# EAGLE design HEXTIr_v1.1 (EAGLE 7.7.0)
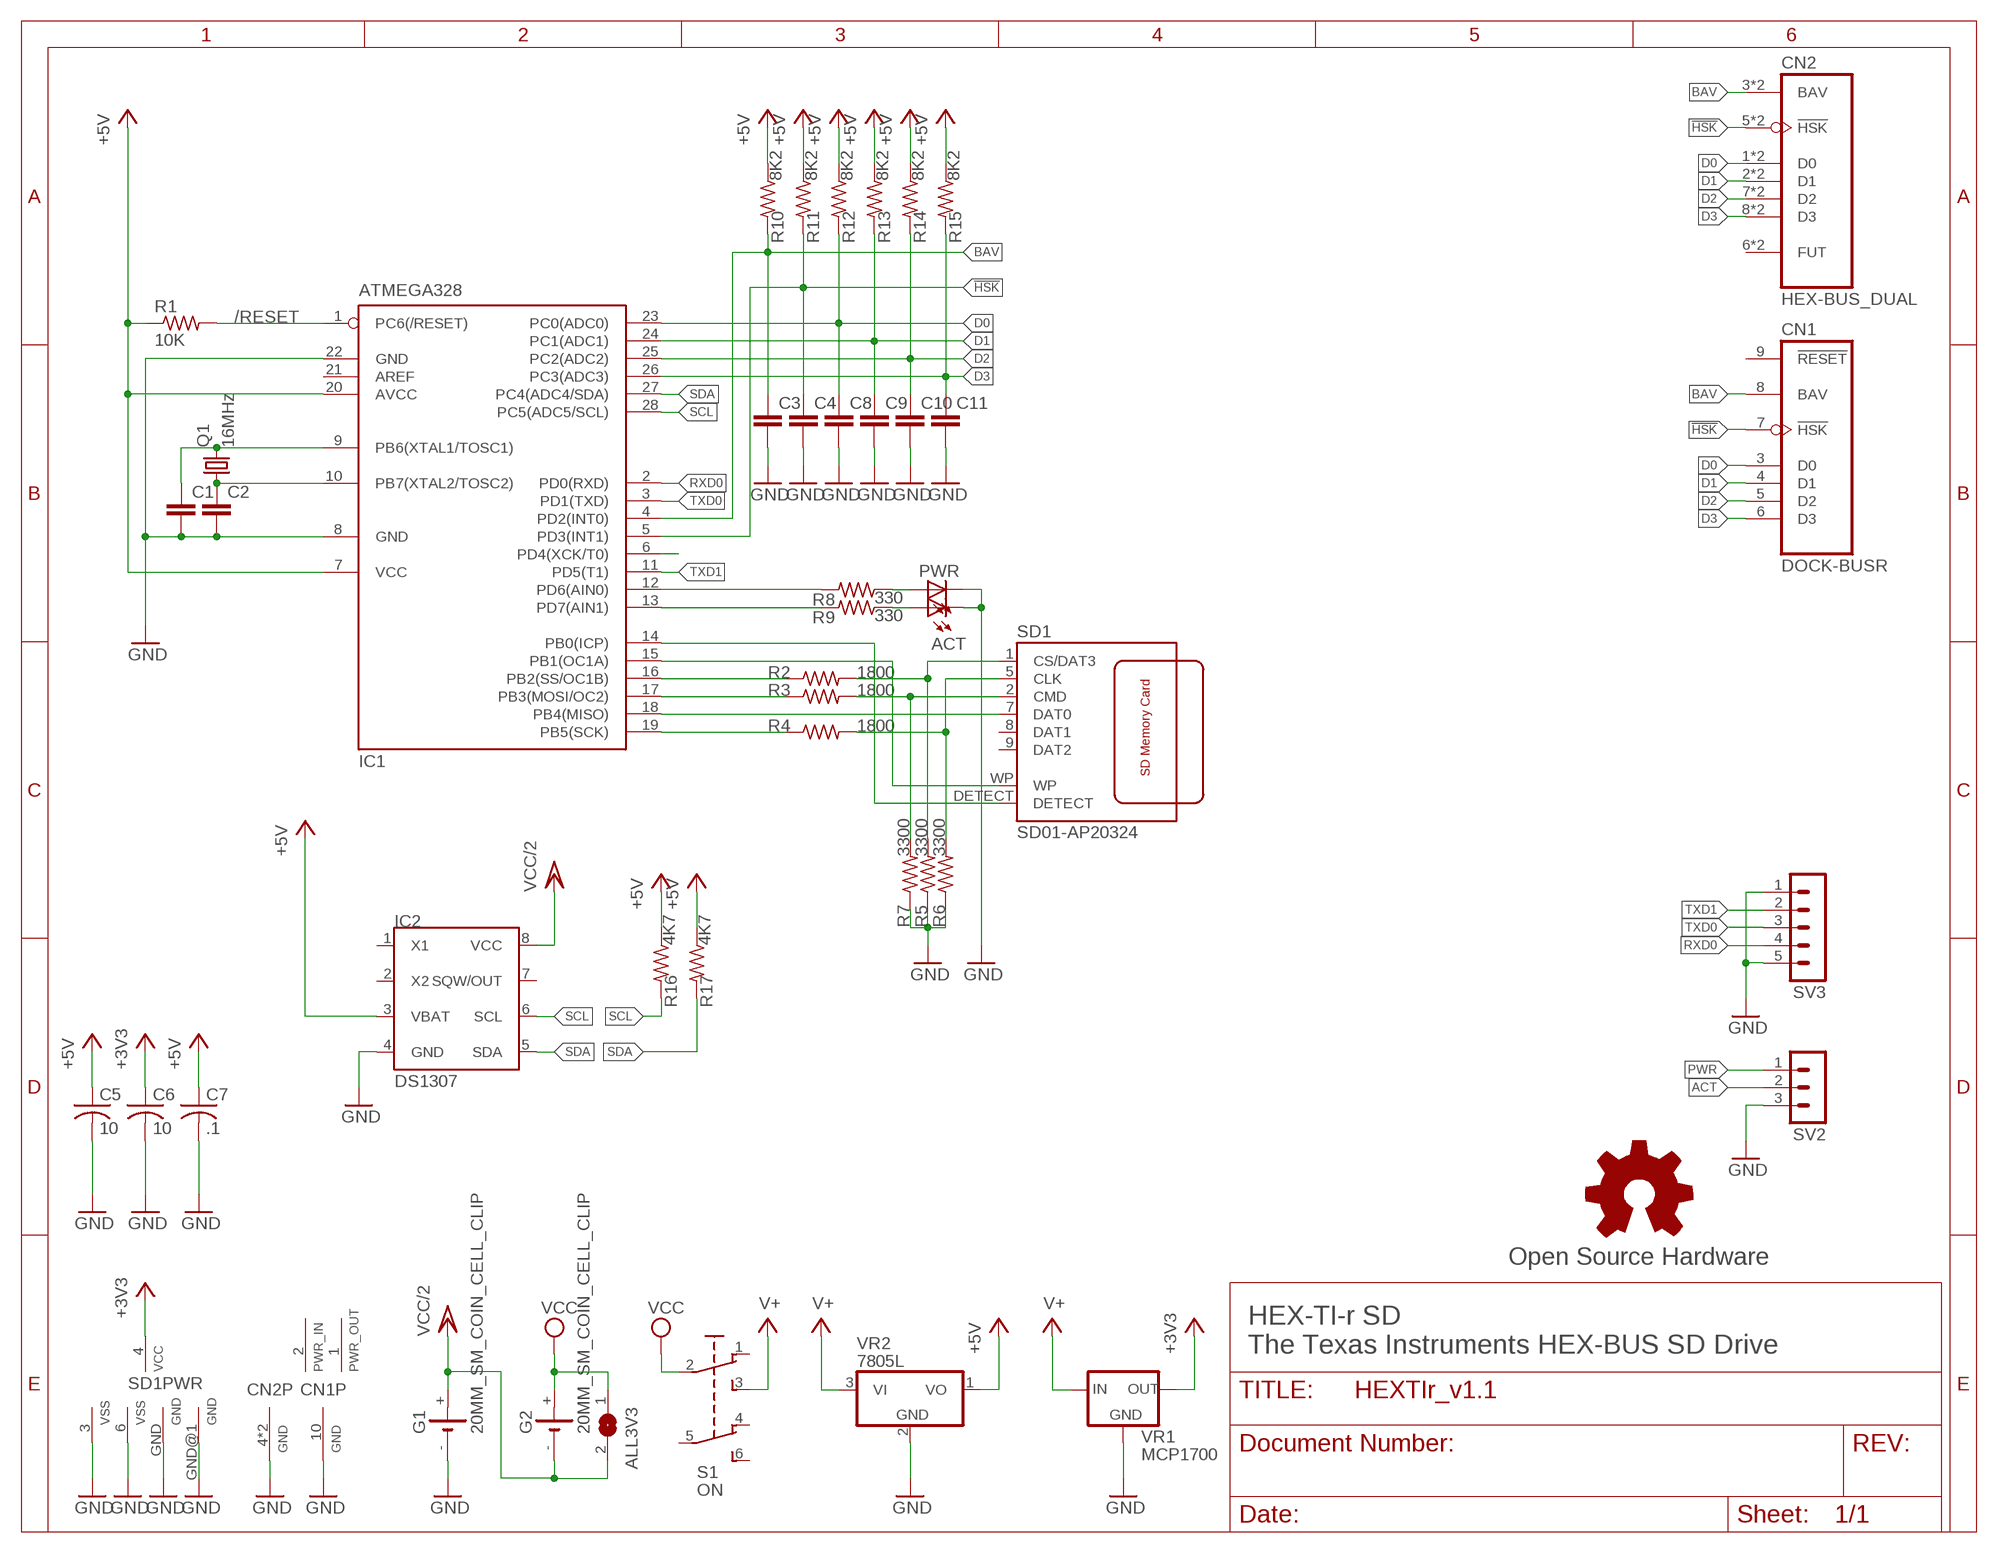
[diagram p0: schematic, sheet 1]

## Parts
ACT  LED3MM  [LED3MM]
ALL3V3  SJ  [SJ]
C1  C-EU025-024X044  [C025-024X044]
C2  C-EU025-024X044  [C025-024X044]
C3  C-EU025-024X044  [C025-024X044]
C4  C-EU025-024X044  [C025-024X044]
C5  10  C-US025-025X050  [C025-025X050]
C6  10  C-US025-025X050  [C025-025X050]
C7  .1  C-US025-025X050  [C025-025X050]
C8  C-EU025-024X044  [C025-024X044]
C9  C-EU025-024X044  [C025-024X044]
C10  C-EU025-024X044  [C025-024X044]
C11  C-EU025-024X044  [C025-024X044]
CN1  DOCK-BUSR  [DOCK-BUS-RP]
CN2  HEX-BUS_DUAL  [HEX-BUS_DUAL]
G1  20MM_SM_COIN_CELL_CLIP  [20MM_SM_COIN_CELL_CLIP]
G2  20MM_SM_COIN_CELL_CLIP  [20MM_SM_COIN_CELL_CLIP]
GOLD_ORB_SM1  Open Source Hardware  OSHWLOGOLOGO5MM  [OSHW_5MM]
IC1  ATMEGA328  MEGA8-P  [DIL28-3]
IC2  DS1307  [DIL08]
PWR  LED3MM  [LED3MM]
Q1  16MHz  CRYSTALHC49U-V  [HC49U-V]
R1  10K  R-US_0204/2V  [0204V]
R2  1800  R-US_0204/2V  [0204V]
R3  1800  R-US_0204/2V  [0204V]
R4  1800  R-US_0204/2V  [0204V]
R5  3300  R-US_0204/2V  [0204V]
R6  3300  R-US_0204/2V  [0204V]
R7  3300  R-US_0204/2V  [0204V]
R8  330  R-US_0204/2V  [0204V]
R9  330  R-US_0204/2V  [0204V]
R10  8K2  R-US_0204/2V  [0204V]
R11  8K2  R-US_0204/2V  [0204V]
R12  8K2  R-US_0204/2V  [0204V]
R13  8K2  R-US_0204/2V  [0204V]
R14  8K2  R-US_0204/2V  [0204V]
R15  8K2  R-US_0204/2V  [0204V]
R16  4K7  R-US_0204/2V  [0204V]
R17  4K7  R-US_0204/2V  [0204V]
S1  ON  TINY-SLIDE  [TINY-SLIDE]
SD1  SD01-AP20324  [SD01-AP20324]
SV2  MA03-1  [MA03-1]
SV3  MA05-1  [MA05-1]
VR1  MCP1700  MCP1700TO92  [TO92]
VR2  7805L  [TO92]

## Nets
!HSK: C4.1 CN1.7(!HSK) CN2.5'(!HSK) CN2.5(!HSK) IC1.5(PD3(INT1)) R11.2
+3V3: C6.1 SD1.4(3V3) VR1.3(OUT)
+5V: C5.1 C7.1 IC1.7(VCC) IC1.20(AVCC) IC2.3(VBAT) R1.1 R10.1 R11.1 R12.1 R13.1 R14.1 R15.1 R16.1 R17.1 VR2.1(VO)
/RESET: IC1.1(PC6(/RESET)) R1.2
ACT: IC1.13(PD7(AIN1)) R9.2 SV2.2
B2: C1.1 IC1.9(PB6(XTAL1/TOSC1)) Q1.2
B3: C2.1 IC1.10(PB7(XTAL2/TOSC2)) Q1.1
BAV: C3.1 CN1.8(BAV) CN2.3'(BAV) CN2.3(BAV) IC1.4(PD2(INT0)) R10.2
D0: C8.1 CN1.3(D0) CN2.1'(D0) CN2.1(D0) IC1.23(PC0(ADC0)) R12.2
D1: C9.1 CN1.4(D1) CN2.2'(D1) CN2.2(D1) IC1.24(PC1(ADC1)) R13.2
D2: C10.1 CN1.5(D2) CN2.7'(D2) CN2.7(D2) IC1.25(PC2(ADC2)) R14.2
D3: C11.1 CN1.6(D3) CN2.8'(D3) CN2.8(D3) IC1.26(PC3(ADC3)) R15.2
GND: ACT.K(C) C1.2 C2.2 C3.2 C4.2 C5.2 C6.2 C7.2 C8.2 C9.2 C10.2 C11.2 CN1.10(GND) CN2.4'(GND) CN2.4(GND) G1.- IC1.8(GND) IC1.22(GND) IC2.4(GND) PWR.K(C) R5.1 R6.1 R7.1 SD1.3(VSS) SD1.6(VSS) SD1.GND SD1.GND@1(GND) SV2.3 SV3.1 SV3.5 VR1.1(GND) VR2.2(GND)
MISO: IC1.18(PB4(MISO)) SD1.7(DAT0)
MOSI: IC1.17(PB3(MOSI/OC2)) R3.1
N$1: R2.2 R5.2 SD1.1(CS/DAT3)
N$2: R3.2 R7.2 SD1.2(CMD)
N$4: R4.2 R6.2 SD1.5(CLK)
N$5: IC1.15(PB1(OC1A)) SD1.WP
N$6: IC1.14(PB0(ICP)) SD1.DETECT
N$23: IC1.6(PD4(XCK/T0))
N$26: ACT.A R9.1
N$27: PWR.A R8.1
PWR: IC1.12(PD6(AIN0)) R8.2 SV2.1
RXD0: IC1.2(PD0(RXD)) SV3.4
SCK: IC1.19(PB5(SCK)) R4.1
SCL: IC1.28(PC5(ADC5/SCL)) IC2.6(SCL) R16.2
SDA: IC1.27(PC4(ADC4/SDA)) IC2.5(SDA) R17.2
SS: IC1.16(PB2(SS/OC1B)) R2.1
TXD0: IC1.3(PD1(TXD)) SV3.3
TXD1: IC1.11(PD5(T1)) SV3.2
V+: S1.3(S) VR1.2(IN) VR2.3(VI)
VCC: ALL3V3.1 G2.+ S1.2(P)
VCC/2: ALL3V3.2 G1.+ G2.- IC2.8(VCC)
Unconnected: CN1.9(!RESET) CN2.6'(FUT) CN2.6(FUT) IC1.21(AREF) IC2.1(X1) IC2.2(X2) IC2.7(SQW/OUT) S1.1(O) S1.4(O1) S1.5(P1) S1.6(S1) SD1.8(DAT1) SD1.9(DAT2)

## Notes on the sheet
- HEX-TI-r SD
  The Texas Instruments HEX-BUS SD Drive

## Power pins joined to a net without a drawn wire
PWN_IN: CN1.2(PWN_IN)
PWR_OUT: CN1.1(PWR_OUT)

## Library data of the parts
ACT PWR = led:LED: LED OSRAM: - CHIPLED LG R971, LG N971, LY N971, LG Q971, LY Q971, LO R971, LY R971 LH N974, LH R974 LS Q976, LO Q976, LY Q976 LO Q996 - Hyper CHIPLED LW Q18S LB Q993, LB Q99A, LB R99A - SideLED LS A670, LO A670, LY A670, LG A670, LP A670 LB A673, LV A673, LT A673, LW A673 LH A674 LY A675 LS A676, LA A676, LO A676, LY A676, LW A676 LS A679, LY A679, LG A679 - Hyper Micro SIDELED® LS Y876, LA Y876, LO Y876, LY Y876 LT Y87S - SmartLED LW L88C, LW L88S LB L89C, LB L89S, LG L890 LS L89K, LO L89K, LY L89K LS L896, LA L896, LO L896, LY L896 - TOPLED LS T670, LO T670, LY T670, LG T670, LP T670 LSG T670, LSP T670, LSY T670, LOP T670, LYG T670 LG T671, LOG T671, LSG T671 LB T673, LV T673, LT T673, LW T673 LH T674 LS T676, LA T676, LO T676, LY T676, LB T676, LH T676, LSB T676, LW T676 LB T67C, LV T67C, LT T67C, LS T67K, LO T67K, LY T67K, LW E67C LS E67B, LA E67B, LO E67B, LY E67B, LB E67C, LV E67C, LT E67C LW T67C LS T679, LY T679, LG T679 LS T770, LO T770, LY T770, LG T770, LP T770 LB T773, LV T773, LT T773, LW T773 LH T774 LS E675, LA E675, LY E675, LS T675 LS T776, LA T776, LO T776, LY T776, LB T776 LHGB T686 LT T68C, LB T68C - Hyper Mini TOPLED® LB M676 - Mini TOPLED Santana® LG M470 LS M47K, LO M47K, LY M47K Source: http://www.osram.convergy.de LUXEON: - LUMILED® LXK2-PW12-R00, LXK2-PW12-S00, LXK2-PW14-U00, LXK2-PW14-V00 LXK2-PM12-R00, LXK2-PM12-S00, LXK2-PM14-U00 LXK2-PE12-Q00, LXK2-PE12-R00, LXK2-PE12-S00, LXK2-PE14-T00, LXK2-PE14-U00 LXK2-PB12-K00, LXK2-PB12-L00, LXK2-PB12-M00, LXK2-PB14-N00, LXK2-PB14-P00, LXK2-PB14-Q00 LXK2-PR12-L00, LXK2-PR12-M00, LXK2-PR14-Q00, LXK2-PR14-R00 LXK2-PD12-Q00, LXK2-PD12-R00, LXK2-PD12-S00 LXK2-PH12-R00, LXK2-PH12-S00 LXK2-PL12-P00, LXK2-PL12-Q00, LXK2-PL12-R00 Source: www.luxeon.com KINGBRIGHT: KA-3528ASYC Source: www.kingbright.com
ALL3V3 = jumper:SJ: SMD solder JUMPER
C1-C4 C8-C11 = rcl:C-EU: CAPACITOR, European symbol
C5-C7 = rcl:C-US: CAPACITOR, American symbol
CN1 = ti-cc40:DOCK-BUS
CN2 = ti-cc40:HEX-BUS_DUAL: TI HexBus Connector
G1 G2 = battery-jlb:20MM_SM_COIN_CELL_CLIP: Battery cell clip for CR927 Source: KEYSTONE ELECTRONICS CORP. www.keyelco.com, ASTORIA, N.Y. 11105-2017 PART ANME 10mm SM COIN CELl CLIP DWG NO. 3030
GOLD_ORB_SM1 = oshw:OSHWLOGO: The OSHW logo for PCB layout
IC1 = atmel:MEGA8-P: MICROCONTROLLER 8 Kbytes FLASH, 1 kbytes SRAM, 512 bytes EEPROM, USART, 4-channel 10 bit ADC, 2-channel 8 bit ADC Pin compatible with Atmega48, ATMega88, ATMega168 Source: avr.lbr; OC_FARNELL: unknown; OC_NEWARK: unknown
IC2 = dallas-rtc:DS1307: I2C Serial RTC w/56 bytes battery backed RAM
Q1 = crystal:CRYSTAL: CRYSTAL; OC_FARNELL: 1666969; OC_NEWARK: unknown
R1 = resistor:R-US_: RESISTOR, American symbol
R2-R17 = rcl:R-US_: RESISTOR, American symbol
S1 = switch-jlb:TINY-SLIDE: TINY SWITCH ON - MOM Source: http://www2.produktinfo.conrad.com/datenblaetter/700000-724999/705152-da-01-de-Subminiaturschalter_TL_36WO.pdf
SD1 = con-atom-sd:SD01-AP20324
SV2 = con-lstb-rp:MA03-1: PIN HEADER; OC_FARNELL: unknown; OC_NEWARK: unknown
SV3 = con-lstb-rp:MA05-1: PIN HEADER; OC_FARNELL: unknown; OC_NEWARK: unknown
VR1 = microchip-vr:MCP1700: MCP1700 Low Quiescent Current LDO Voltage Regulator
VR2 = linear:78*: Positive VOLTAGE REGULATOR Source: http://cache.national.com/ds/LM/LM78L05.pdf http://www.fairchildsemi.com/ds/LM/LM7805.pdf

## Board
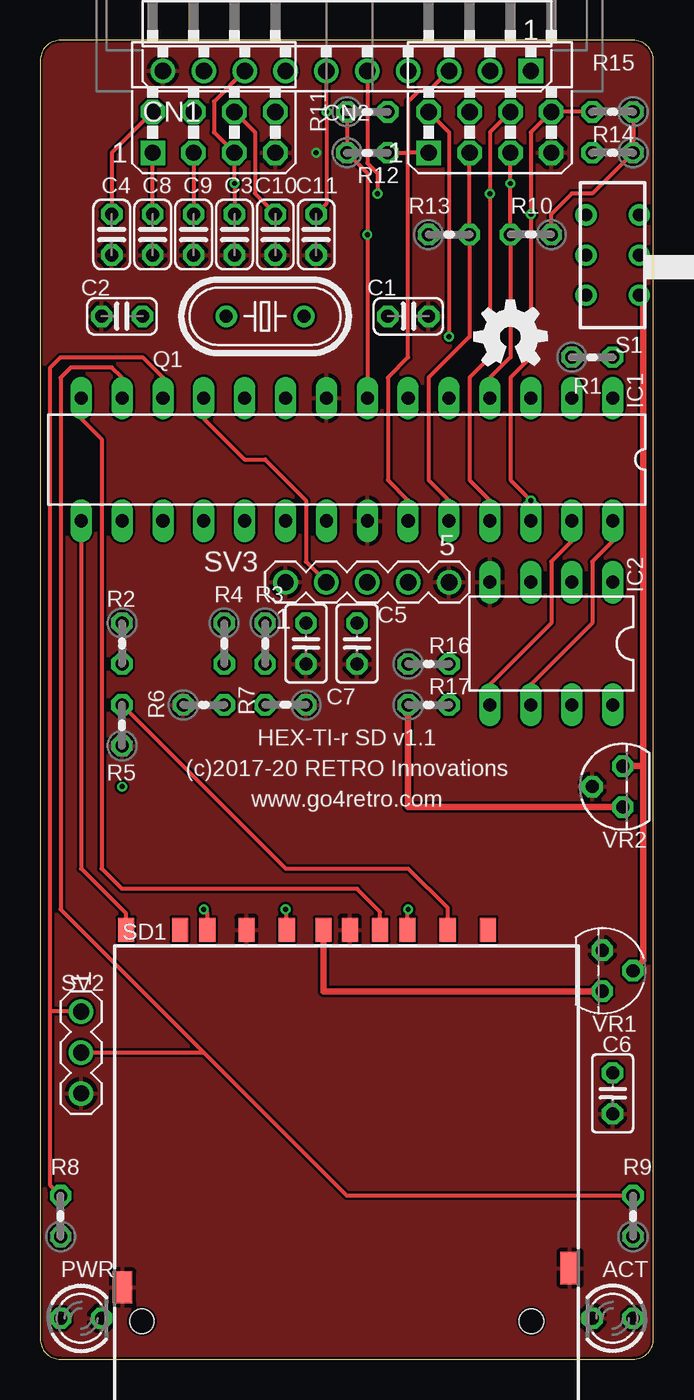
[diagram p1: board, top side]
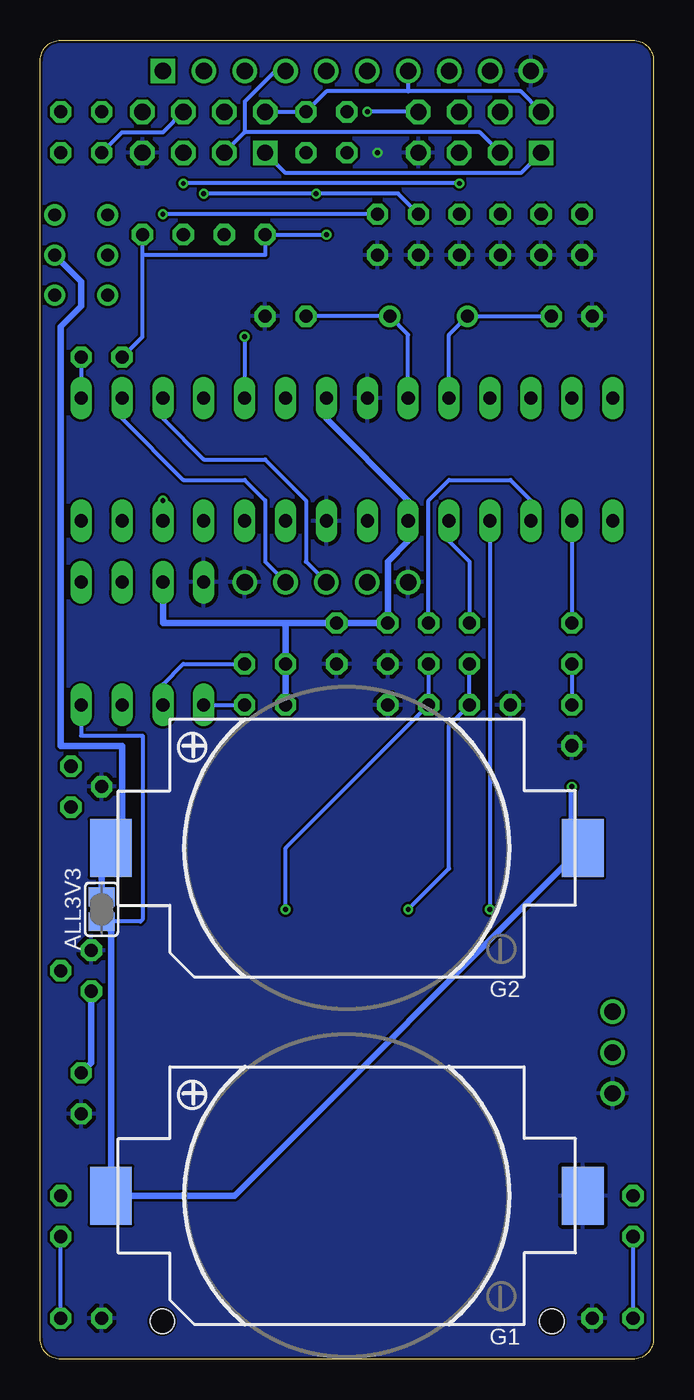
[diagram p2: board, bottom side, seen from below]

Size 38.1 x 81.92 mm. Coordinates in mm from the lower left corner, seen from the top.
Outline: 36.83,81.92 1.27,81.92 arc90 0,80.64 0,1.27 arc90 1.27,0 36.83,0 arc90 38.1,1.27 38.1,80.64 arc90 36.83,81.92
Copper layers (1*16): Top 0.035mm / dielectric 1.5mm / Bottom 0.035mm
Design rules "hackvana": minimum track width 6mil, minimum drill 0.3mm, track to track 6mil, track to pad 6mil, pad to pad 6mil, via to via 6mil, smd to smd 0mil, copper to edge 6mil, drill to drill 6mil, minimum pad ring 10mil, minimum via ring 6mil, stop-mask expansion 2mil, vias tented up to drill 100mil, thermal gap 10mil

### Footprints (pad centres in the part's own frame; a part is rotated, then mirrored left to right if it is on the bottom)
LED3MM = drill 0.813 octagon: A -1.27,0; K 1.27,0
SJ = smd 1.168 x 1.6: 1 -0.762,0; 2 0.762,0
C025-024X044 = drill 0.813 octagon: 1 -1.27,0; 2 1.27,0
C025-025X050 = drill 0.813 octagon: 1 -1.27,0; 2 1.27,0
DOCK-BUS-RP = drill 1.016 square: 1 11.43,0 | drill 1.016: 2 8.89,0; 3 6.35,0; 4 3.81,0; 5 1.27,0; 6 -1.27,0; 7 -3.81,0; 8 -6.35,0; 9 -8.89,0; 10 -11.43,0
HEX-BUS_DUAL = drill 1.016 square: 1 -12.7,-1.27; 1' 4.445,-1.27 | drill 1.016 octagon: 2 -10.16,-1.27; 2' 6.985,-1.27; 3 -7.62,-1.27; 3' 9.525,-1.27; 4 -5.08,-1.27; 4' 12.065,-1.27; 5 -12.7,1.27; 5' 4.445,1.27; 6 -10.16,1.27; 6' 6.985,1.27; 7 -7.62,1.27; 7' 9.525,1.27; 8 -5.08,1.27; 8' 12.065,1.27
20MM_SM_COIN_CELL_CLIP = smd 2.591 x 3.607: + 14.656,0; - -14.656,0
DIL28-3 = drill 0.813 long: 1 -16.51,-3.81; 2 -13.97,-3.81; 3 -11.43,-3.81; 4 -8.89,-3.81; 5 -6.35,-3.81; 6 -3.81,-3.81; 7 -1.27,-3.81; 8 1.27,-3.81; 9 3.81,-3.81; 10 6.35,-3.81; 11 8.89,-3.81; 12 11.43,-3.81; 13 13.97,-3.81; 14 16.51,-3.81; 15 16.51,3.81; 16 13.97,3.81; 17 11.43,3.81; 18 8.89,3.81; 19 6.35,3.81; 20 3.81,3.81; 21 1.27,3.81; 22 -1.27,3.81; 23 -3.81,3.81; 24 -6.35,3.81; 25 -8.89,3.81; 26 -11.43,3.81; 27 -13.97,3.81; 28 -16.51,3.81
DIL08 = drill 0.813 long: 1 -3.81,-3.81; 2 -1.27,-3.81; 3 1.27,-3.81; 4 3.81,-3.81; 5 3.81,3.81; 6 1.27,3.81; 7 -1.27,3.81; 8 -3.81,3.81
HC49U-V = drill 0.813: 1 -2.413,0; 2 2.413,0
0204V = drill 0.813 octagon: 1 -1.27,0; 2 1.27,0
TINY-SLIDE = drill 0.8: 1 -2.489,1.65; 2 0,1.65; 3 2.489,1.65; 4 -2.489,-1.65; 5 0,-1.65; 6 2.489,-1.65
SD01-AP20324 = smd 1 x 1.5: 1 -7.535,-13.97; 2 -5.035,-13.97; 3 -1.46,-13.97; 4 0.19,-13.97; 5 2.465,-13.97; 6 4.965,-13.97; 7 7.395,-13.97; 8 9.095,-13.97; 9 -10.035,-13.97; DETECT -3.335,-13.97; WP 12.445,-13.97 | smd 1.2 x 2: GND 12.665,8.24; GND@1 -15.135,7.04 | hole 1.5: -12.735,10.34; 11.465,10.34
MA03-1 = drill 1.016: 1 -2.54,0; 2 0,0; 3 2.54,0
MA05-1 = drill 1.016: 1 -5.08,0; 2 -2.54,0; 3 0,0; 4 2.54,0; 5 5.08,0
TO92 = drill 0.813 octagon: 1 -1.27,0; 2 0,1.905; 3 1.27,0

### Placement (x,y rotation side)
ACT  35.56,2.54 180 top
ALL3V3  34.29,27.94 270 bottom
C1  22.86,64.77 0 top
C2  5.08,64.77 180 top
C3  12.07,69.85 270 top
C4  4.45,69.85 270 top
C5  19.69,44.45 270 top
C6  35.56,16.51 270 top
C7  16.51,44.45 270 top
C8  6.99,69.85 270 top
C9  9.53,69.85 270 top
C10  14.61,69.85 270 top
C11  17.14,69.85 270 top
CN1  19.05,80.01 0 top
CN2  19.69,76.2 0 top
G1  19.05,10.16 180 bottom
G2  19.05,31.75 180 bottom
GOLD_ORB_SM1  29.21,63.5 0 top
IC1  19.05,55.88 180 top
IC2  31.75,44.45 180 top
PWR  2.54,2.54 0 top
Q1  13.97,64.77 0 top
R1  34.29,62.23 0 top
R2  5.08,44.45 270 top
R3  13.97,44.45 270 top
R4  11.43,44.45 270 top
R5  5.08,39.37 90 top
R6  10.16,40.64 0 top
R7  15.24,40.64 180 top
R8  1.27,8.89 90 top
R9  36.83,8.89 90 top
R10  30.48,69.85 180 top
R11  20.32,77.47 0 top
R12  20.32,74.93 0 top
R13  25.4,69.85 0 top
R14  35.56,74.93 180 top
R15  35.56,77.47 180 top
R16  24.13,43.18 0 top
R17  24.13,40.64 0 top
S1  35.56,68.58 270 top
SD1  17.78,12.7 180 top
SV2  2.54,19.05 270 top
SV3  20.32,48.26 0 top
VR1  34.92,24.13 270 top
VR2  36.2,35.56 90 top

### Tracks (layer width: path | path; a pad name or v marks a point on that pad's centre or on a via)
!HSK  (via drill 0.3)
  Top 0.254: C4.1 4.45,74.93 CN2.5 | v25.4,63.5 25.4,76.2 CN2.5'
  Bottom 0.254: v25.4,63.5 IC1.5 | CN2.5 8.26,78.74 15.24,78.74 | CN1.7 15.24,78.74 | CN2.5' R11.2 20.32,78.74 15.24,78.74
+3V3
  Top 0.406: SD1.4 17.59,22.86 VR1.3
  Bottom 0.406: VR1.3 34.92,18.41 C6.1
+5V  (via drill 0.3)
  Top 0.254: R15.1 R14.1 34.29,72.39 33.02,72.39 31.75,71.12 R10.1 | IC1.7 v20.32,69.85 20.32,73.66 R12.1 R11.1
  Top 0.406: VR2.1 22.86,34.29 R17.1
  Bottom 0.254: 31.75,68.58 24.13,68.58 R13.1 v20.32,69.85 | 31.75,68.58 R10.1 | R1.1 31.75,63.5 31.75,68.58
  Bottom 0.406: IC1.7 20.32,58.42 15.24,53.34 IC1.20 15.24,50.8 16.51,49.53 C7.1 C5.1 22.86,45.72 | R16.1 R17.1 22.86,45.72 | IC2.3 30.48,45.72 22.86,45.72
/RESET
  Bottom 0.254: R1.2 IC1.1
ACT
  Top 0.254: R9.2 19.05,10.16 10.16,19.05 | 10.16,19.05 1.27,27.94 1.27,60.96 1.91,61.59 4.45,61.59 5.08,60.96 IC1.13 | SV2.2 10.16,19.05
B2
  Bottom 0.254: IC1.9 15.24,63.63 Q1.2 C1.1
B3
  Bottom 0.254: IC1.10 12.7,63.63 Q1.1 C2.1
BAV  (via drill 0.3)
  Top 0.254: C3.1 v12.07,73.03 CN2.3 10.79,76.2 10.79,78.11 CN1.8 | IC1.4 27.94,60.96 29.21,62.23 R10.2 v29.21,73.03 CN2.3'
  Bottom 0.254: v12.07,73.03 v29.21,73.03
D0
  Top 0.254: IC1.23 22.86,53.34 21.59,54.61 21.59,60.96 22.86,62.23 22.86,74.93 | R12.2 22.86,74.93 | CN2.1' 22.86,74.93 | C8.1 CN2.1 | CN1.3 24.13,78.74 23.5,78.74 22.86,78.11 22.86,74.93
  Bottom 0.254: CN2.1 8.26,73.66 22.86,73.66 CN2.1'
D1
  Top 0.254: IC1.24 25.4,53.34 24.13,54.61 24.13,60.96 26.67,63.5 R13.2 CN2.2' | CN2.2 C9.1
  Bottom 0.254: CN2.2 10.79,76.2 25.4,76.2 | 25.4,76.2 CN2.2' | CN1.4 23.5,80.01 25.4,78.11 25.4,76.2
D2  (via drill 0.3)
  Top 0.254: C10.1 13.34,72.39 13.34,76.2 CN2.7 | IC1.25 27.94,53.34 26.67,54.61 26.67,60.96 27.94,62.23 v27.94,72.39 27.94,76.2 CN2.7' | CN1.5 20.32,74.3 20.96,73.66 v20.96,72.39
  Bottom 0.254: R14.2 33.02,76.2 30.48,76.2 CN2.7' | C10.1 15.88,72.39 v20.96,72.39 22.86,72.39 v27.94,72.39
D3  (via drill 0.3)
  Top 0.254: C11.1 17.78,71.75 v17.78,77.47 CN1.6 | v30.48,53.34 29.21,54.61 29.21,60.96 30.48,62.23 v30.48,71.12 30.48,76.2 CN2.8' R15.2
  Bottom 0.254: v30.48,53.34 IC1.26 | C11.1 v30.48,71.12 | CN2.8 v17.78,77.47
GND  (via drill 0.3)
  other vias: 17.14,74.93
  pour Bottom: 1.27,0 36.83,0 arc90 38.1,1.27 38.1,80.64 arc90 36.83,81.92 1.27,81.92 arc90 0,80.64 0,1.27 arc90
  pour Top: 1.27,0 36.83,0 arc90 38.1,1.27 38.1,80.64 arc90 36.83,81.92 1.27,81.92 arc90 0,80.64 0,1.27 arc90
MISO  (via drill 0.3)
  Top 0.254: SD1.7 10.39,27.71 v10.16,27.94
  Bottom 0.254: IC1.18 v10.16,27.94
MOSI
  Bottom 0.254: R3.1 13.97,53.34 12.7,54.61 8.89,54.61 7.62,53.34 IC1.17
N$1
  Top 0.254: SD1.1 25.32,28.02 22.86,30.48 15.24,30.48 R5.2
  Bottom 0.254: R2.2 R5.2
N$2  (via drill 0.3)
  Top 0.254: SD1.2 22.82,27.98 v22.86,27.94
  Bottom 0.254: R3.2 R7.2 22.86,31.75 v22.86,27.94
N$4  (via drill 0.3)
  Top 0.254: SD1.5 15.32,27.86 v15.24,27.94
  Bottom 0.254: v15.24,27.94 12.7,30.48 12.7,39.37 R6.2 R4.2
N$5
  Top 0.254: SD1.WP 5.34,27.68 2.54,30.48 IC1.15
N$6
  Top 0.254: SD1.DETECT 21.12,27.78 19.69,29.21 5.08,29.21 3.81,30.48 3.81,57.15 2.54,58.42 IC1.14
N$26
  Bottom 0.254: ACT.A R9.1
N$27
  Bottom 0.254: PWR.A R8.1
PWR
  Top 0.254: R8.2 0.64,10.79 0.64,21.59 | 0.64,21.59 0.64,61.59 1.27,62.23 6.35,62.23 7.62,60.96 IC1.12 | SV2.1 0.64,21.59
RXD0
  Bottom 0.254: IC1.2 33.02,58.42 29.21,54.61 25.4,54.61 24.13,53.34 24.13,49.53 SV3.4
SCK
  Bottom 0.254: IC1.19 12.7,50.8 11.43,49.53 R4.1
SCL
  Top 0.254: IC1.28 35.56,50.8 34.29,49.53 34.29,45.72 30.48,41.91 IC2.6
  Bottom 0.254: IC2.6 30.48,41.91 29.21,43.18 R16.2
SDA
  Top 0.254: IC1.27 33.02,50.8 31.75,49.53 31.75,45.72 27.94,41.91 IC2.5
  Bottom 0.254: IC2.5 R17.2
SS
  Bottom 0.254: IC1.16 R2.1
TXD0
  Bottom 0.254: IC1.3 30.48,58.42 27.94,55.88 24.13,55.88 21.59,53.34 21.59,49.53 SV3.3
TXD1
  Top 0.254: IC1.11 10.16,58.42 12.7,55.88 13.97,55.88 16.51,53.34 16.51,49.53 SV3.2
V+
  Top 0.406: 37.47,36.83 37.47,65.84 S1.3 | 37.47,36.83 37.47,24.77 VR1.2 | 37.47,36.83 VR2.3
VCC
  Bottom 0.406: ALL3V3.1 34.29,31.75 | 34.29,31.75 G2.+ 33.02,31.75 33.02,38.1 36.83,38.1 36.83,64.14 35.56,65.41 35.56,66.93 S1.2 | 34.29,31.75 33.66,32.38
VCC/2  (via drill 0.3)
  Bottom 0.254: IC2.8 35.56,38.73 31.75,38.73 31.75,27.3 31.88,27.18 ALL3V3.2
  Bottom 0.406: ALL3V3.2 33.71,26.59 G1.+ 26.04,10.16 4.45,31.75 G2.- 5.08,32.44 v5.08,35.56

### Text on the board
tNames: HEX-TI-r SD v1.1 | (c)2017-20 RETRO Innovations | www.go4retro.com